# Altium schematic sheet Oscilloscope.schdoc
size 219 x 297 mm
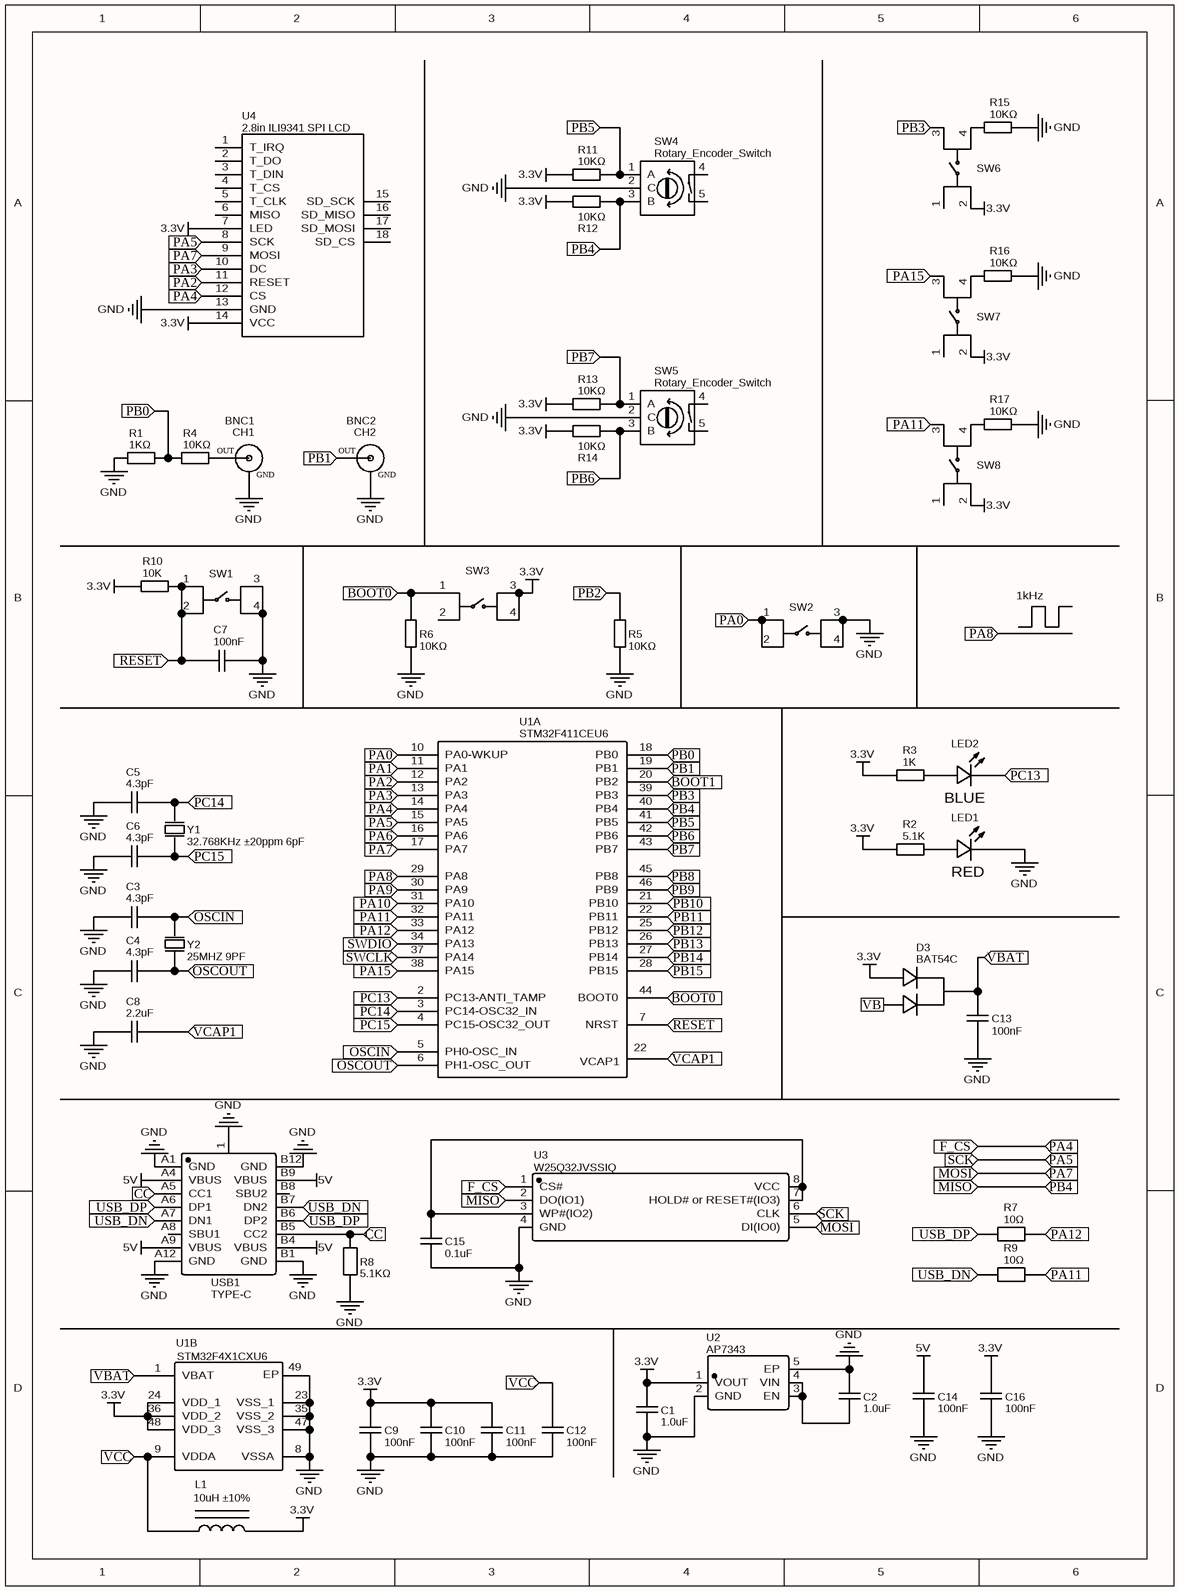
[diagram p0: Oscilloscope.schdoc]

## Parts
BNC1  CH1  [BNC]
BNC2  CH2  [BNC]
C1  1.0uF  [C0603]
C2  1.0uF  [C0603]
C3  4.3pF  [C0603]
C4  4.3pF  [C0603]
C5  4.3pF  [C0603]
C6  4.3pF  [C0603]
C7  100nF  [0603_1608METRIC_PAD1.05X0.95MM_HANDSOLDER]
C8  2.2uF  [C0603]
C9  100nF  [C0603]
C10  100nF  [C0603]
C11  100nF  [C0603]
C12  100nF  [C0603]
C13  100nF  [C0603]
C14  100nF  [C0603]
C15  0.1uF  [C0603]
C16  100nF  [C0603]
D3  BAT54C  [SOT-23-3_L2.9-W1.6-P1.90-LS2.8-BR]
L1  10uH ±10%  [L0603]
LED1  XL-0603QYGC  [LED-0603]  (value not drawn)
LED2  XL-0603QYGC  [LED-0603]  (value not drawn)
R1  1KΩ  [0603_1608METRIC_PAD1.05X0.95MM_HANDSOLDER]
R2  5.1K  [0603_1608METRIC_PAD1.05X0.95MM_HANDSOLDER]
R3  1K  [0603_1608METRIC_PAD1.05X0.95MM_HANDSOLDER]
R4  10KΩ  [0603_1608METRIC_PAD1.05X0.95MM_HANDSOLDER]
R5  10KΩ  [0603_1608METRIC_PAD1.05X0.95MM_HANDSOLDER]
R6  10KΩ  [0603_1608METRIC_PAD1.05X0.95MM_HANDSOLDER]
R7  10Ω  [R0603]
R8  5.1KΩ  [R0603]
R9  10Ω  [R0603]
R10  10K  [0603_1608METRIC_PAD1.05X0.95MM_HANDSOLDER]
R11  10KΩ  [0603_1608METRIC_PAD1.05X0.95MM_HANDSOLDER]
R12  10KΩ  [0603_1608METRIC_PAD1.05X0.95MM_HANDSOLDER]
R13  10KΩ  [0603_1608METRIC_PAD1.05X0.95MM_HANDSOLDER]
R14  10KΩ  [0603_1608METRIC_PAD1.05X0.95MM_HANDSOLDER]
R15  10KΩ  [0603_1608METRIC_PAD1.05X0.95MM_HANDSOLDER]
R16  10KΩ  [0603_1608METRIC_PAD1.05X0.95MM_HANDSOLDER]
R17  10KΩ  [0603_1608METRIC_PAD1.05X0.95MM_HANDSOLDER]
SW1  K2-6639SP-C4SC-04  [KEY-6.0*6.0]  (value not drawn)
SW2  K2-6639SP-C4SC-04  [KEY-6.0*6.0]  (value not drawn)
SW3  K2-6639SP-C4SC-04  [KEY-6.0*6.0]  (value not drawn)
SW4  Rotary_Encoder_Switch
SW5  Rotary_Encoder_Switch
SW6  K2-6639SP-C4SC-04  [KEY-6.0*6.0]  (value not drawn)
SW7  K2-6639SP-C4SC-04  [KEY-6.0*6.0]  (value not drawn)
SW8  K2-6639SP-C4SC-04  [KEY-6.0*6.0]  (value not drawn)
U1A  STM32F411CEU6  [ST-LQFP48]
U1B  STM32F4X1CXU6  [ST-LQFP48]
U2  AP7343  [X2-DFN1010-4_L1.0-W1.0-P0.65-BL-EP]
U3  W25Q32JVSSIQ  [SOIC-8_L5.3-W5.3-P1.27-LS8.0-BL]
U4  2.8in ILI9341 SPI LCD  [2.8IN-ILI9341-SPI-LCD]
USB1  TYPE-C  [TYPE-C-SMD_TYPE-CF3.1]
Y1  32.768KHz ±20ppm 6pF  [OSC-49S-1]
Y2  25MHZ 9PF  [OSC-49S-1]

## Ports
BOOT0 (in), BOOT1 (in), CC (in), F_CS (in), MISO (in), MOSI (in), OSCIN (in), OSCOUT (in), PA0 (in), PA1 (in), PA2 (in), PA3 (in), PA4 (in), PA5 (in), PA6 (in), PA7 (in), PA8 (in), PA9 (in), PA10 (in), PA11 (in), PA12 (in), PA15 (in), PB0 (in), PB1 (in), PB2 (in), PB3 (in), PB4 (in), PB5 (in), PB6 (in), PB7 (in), PB8 (in), PB9 (in), PB10 (in), PB11 (in), PB12 (in), PB13 (in), PB14 (in), PB15 (in), PC13 (in), PC14 (in), PC15 (in), RESET (in), SCK (in), SWCLK (in), SWDIO (in), USB_DN (in), USB_DP (in), VB (in), VBAT (in), VCAP1 (in), VCC (in)

## Nets
3.3V: C1.1 C9.1 C10.1 C11.1 C16.1 D3.1(A1) L1.2 R2.1 R3.1 R10.2 R11.2 R12.2 R13.2 R14.2 SW3.3 SW3.4 SW6.2 SW7.2 SW8.2 U1B.24(VDD_1) U1B.36(VDD_2) U1B.48(VDD_3) U2.1(VOUT) U4.7(LED) U4.14(VCC)
5V: C14.1 USB1.A4(VBUS) USB1.A9(VBUS) USB1.B4(VBUS) USB1.B9(VBUS)
GND: BNC1.GND BNC2.GND C1.2 C2.1 C3.1 C4.1 C5.1 C6.1 C7.2 C8.1 C9.2 C10.2 C11.2 C12.2 C13.2 C14.2 C15.2 C16.2 LED1.2(K) R1.1 R5.1 R6.1 R8.2 R15.1 R16.1 R17.1 SW1.3 SW1.4 SW2.3 SW2.4 SW4.2(C) SW5.2(C) U1B.8(VSSA) U1B.23(VSS_1) U1B.35(VSS_2) U1B.47(VSS_3) U2.2(GND) U2.5(EP) U3.4(GND) U4.13(GND) USB1.1(EH) USB1.A1(GND) USB1.A12(GND) USB1.B1(GND) USB1.B12(GND)
BOOT0: R6.2 SW3.1 U1A.44(BOOT0) ; port BOOT0
BOOT1: U1A.20(PB2) ; port BOOT1
CC: R8.1 USB1.A5(CC1) USB1.B5(CC2) ; port CC
F_CS: U1A.14(PA4) U3.1(CS#) U4.12(CS) ; port PA4, port F_CS
MISO: R12.1 SW4.3(B) U1A.40(PB4) U3.2(DO(IO1)) ; port PB4, port MISO
MOSI: U1A.17(PA7) U3.5(DI(IO0)) U4.9(MOSI) ; port PA7, port MOSI
OSCIN: C3.2 U1A.5(PH0-OSC_IN) Y2.1(OSC1) ; port OSCIN
OSCOUT: C4.2 U1A.6(PH1-OSC_OUT) Y2.2(OSC2) ; port OSCOUT
PA0: SW2.1 SW2.2 U1A.10(PA0-WKUP) ; port PA0
PA1: U1A.11(PA1) ; port PA1
PA2: U1A.12(PA2) U4.11(RESET) ; port PA2
PA3: U1A.13(PA3) U4.10(DC) ; port PA3
PA5: U1A.15(PA5) U3.6(CLK) U4.8(SCK) ; port PA5, port SCK
PA6: U1A.16(PA6) ; port PA6
PA8: U1A.29(PA8) ; port PA8
PA9: U1A.30(PA9) ; port PA9
PA10: U1A.31(PA10) ; port PA10
PA11: R9.2 SW8.3 U1A.32(PA11) ; port PA11
PA12: R7.2 U1A.33(PA12) ; port PA12
PA15: SW7.3 U1A.38(PA15) ; port PA15
PB0: R1.2 R4.1 U1A.18(PB0) ; port PB0
PB1: BNC2.S(OUT) U1A.19(PB1) ; port PB1
PB2: R5.2 ; port PB2
PB3: SW6.3 U1A.39(PB3) ; port PB3
PB5: R11.1 SW4.1(A) U1A.41(PB5) ; port PB5
PB6: R14.1 SW5.3(B) U1A.42(PB6) ; port PB6
PB7: R13.1 SW5.1(A) U1A.43(PB7) ; port PB7
PB8: U1A.45(PB8) ; port PB8
PB9: U1A.46(PB9) ; port PB9
PB10: U1A.21(PB10) ; port PB10
PB11: U1A.22(PB11) ; port PB11
PB12: U1A.25(PB12) ; port PB12
PB13: U1A.26(PB13) ; port PB13
PB14: U1A.27(PB14) ; port PB14
PB15: U1A.28(PB15) ; port PB15
PC13: LED2.2(K) U1A.2(PC13-ANTI_TAMP) ; port PC13
PC14: C5.2 U1A.3(PC14-OSC32_IN) Y1.1(OSC1) ; port PC14
PC15: C6.2 U1A.4(PC15-OSC32_OUT) Y1.2(OSC2) ; port PC15
RESET: C7.1 R10.1 SW1.1 SW1.2 U1A.7(NRST) ; port RESET
SWCLK: U1A.37(PA14) ; port SWCLK
SWDIO: U1A.34(PA13) ; port SWDIO
USB_DN: R9.1 USB1.A7(DN1) USB1.B7(DN2) ; port USB_DN
USB_DP: R7.1 USB1.A6(DP1) USB1.B6(DP2) ; port USB_DP
VB: D3.2(A2) ; port VB
VBAT: C13.1 D3.3(K) U1B.1(VBAT) ; port VBAT
VCAP1: C8.2 ; port VCAP1
VCC: C12.1 L1.1 U1B.9(VDDA) ; port VCC
NetBNC1_S: BNC1.S(OUT) R4.2
NetC2_2: C2.2 U2.3(EN) U2.4(VIN)
NetC15_1: C15.1 U3.3(WP#(IO2)) U3.7(HOLD#_or_RESET#(IO3)) U3.8(VCC)
NetLED1_1: LED1.1(A) R2.2
NetLED2_1: LED2.1(A) R3.2
NetR15_2: R15.2 SW6.4
NetR16_2: R16.2 SW7.4
NetR17_2: R17.2 SW8.4

Not connected (* = marked no-connect by the designer): SW3 2; SW4 4 5; SW5 4 5; SW6 1; SW7 1; SW8 1; U4 1(T_IRQ) 2(T_DO) 3(T_DIN) 4(T_CS) 5(T_CLK) 6(MISO) 15(SD_SCK) 16(SD_MISO) 17(SD_MOSI) 18(SD_CS); USB1 A8(SBU1) B8(SBU2)

## Notes on the sheet
- 1kHz
- BLUE
- (near LED1) RED
- (near U1A) VCAP1
- (near U1A) 22
- (near U1B) EP
- (near U1B) 49

## Library data of the parts
BNC1 = CH1: Contributor: SparkFun; spicePre: U; spiceSymbolName: BNC
BNC2 = CH2: Contributor: SparkFun; spicePre: U; spiceSymbolName: BNC
C1 C2 = 1.0uF: nameAlias: Value(F); Contributor: LCEDA_Lib; spicePre: C; spiceSymbolName: C_0603_US
C3-C6 = 4.3pF: nameAlias: Value(F); Contributor: LCEDA_Lib; spicePre: C; spiceSymbolName: C_0603_US
C7 = 100nF: Manufacturer Part: CL10A105KO8NNNC; Manufacturer: SAMSUNG; nameAlias: Capacitance; Supplier: LCSC; Supplier Part: C1592; spicePre: C; spiceSymbolName: CL10A105KO8NNNC
C8 = 2.2uF: nameAlias: Value(F); Contributor: LCEDA_Lib; spicePre: C; spiceSymbolName: C_0603_US
C9-C14 C16 = 100nF: nameAlias: Value(F); Contributor: LCEDA_Lib; spicePre: C; spiceSymbolName: C_0603_US
C15 = 0.1uF: nameAlias: Value(F); Contributor: LCEDA_Lib; spicePre: C; spiceSymbolName: C_0603_US
D3 = BAT54C: Manufacturer: CJ(江苏长电/长晶); Supplier: LCSC; Manufacturer Part: BAT54C; Supplier Part: C2135; JLCPCB Part Class: Extended Part; spicePre: D; spiceSymbolName: BAT54C
L1 = 10uH ±10%: nameAlias: Value(H); Contributor: LCEDA_Lib; spicePre: L; spiceSymbolName: L0603_US
LED1 LED2 = XL-0603QYGC: Manufacturer: KENTO; Supplier: LCSC; Manufacturer Part: XL-0603QYGC; image: //image.lceda.cn/szlcsc/C2289.jpg; Supplier Part: C2289; spicePre: L
R1 = 1KΩ: Manufacturer: YAGEO; Manufacturer Part: RC0603FR-07510RL; nameAlias: Resistance (Ohms); Supplier: LCSC; Supplier Part: C114670; spicePre: R; spiceSymbolName: RC0603FR-07510RL
R2 = 5.1K: Manufacturer: YAGEO; Manufacturer Part: RC0603FR-07510RL; nameAlias: Resistance (Ohms); Supplier: LCSC; Supplier Part: C114670; spicePre: R; spiceSymbolName: RC0603FR-07510RL
R3 = 1K: Manufacturer: YAGEO; Manufacturer Part: RC0603FR-07510RL; nameAlias: Resistance (Ohms); Supplier: LCSC; Supplier Part: C114670; spicePre: R; spiceSymbolName: RC0603FR-07510RL
R4-R6 R11-R17 = 10KΩ: Manufacturer: YAGEO; Manufacturer Part: RC0603FR-07510RL; nameAlias: Resistance (Ohms); Supplier: LCSC; Supplier Part: C114670; spicePre: R; spiceSymbolName: RC0603FR-07510RL
R7 R9 = 10Ω: nameAlias: Value(Ω); Contributor: LCEDA_Lib; spicePre: R; spiceSymbolName: R_0603_EU
R8 = 5.1KΩ: nameAlias: Value(Ω); Contributor: LCEDA_Lib; spicePre: R; spiceSymbolName: R_0603_EU
R10 = 10K: Manufacturer: YAGEO; Manufacturer Part: RC0603JR-0710KL; nameAlias: Resistance (Ohms); Supplier: LCSC; Supplier Part: C99198; spicePre: R; spiceSymbolName: RC0603JR-0710KL
SW1-SW3 SW6-SW8 = K2-6639SP-C4SC-04: Manufacturer: HRO; Supplier: LCSC; Manufacturer Part: K2-6639SP-C4SC-04; Supplier Part: C83206; spicePre: K
SW4 SW5 = Rotary_Encoder_Switch: Contributor: vosemvosemsot; license: https://www.gnu.org/licenses/lgpl-2.1.html; spicePre: S; spiceSymbolName: Rotary_Encoder_Switch
U1A = STM32F411CEU6: Manufacturer: ST; Manufacturer Part: STM32F103C8T6; subpart_no: 1; tags: STM32; timeStamp: 1455028086; Supplier Part: C8734; Supplier: LCSC; image: http://image.lceda.cn/szlcsc/C8734.jpg; spicePre: U
U1B = STM32F4X1CXU6: Manufacturer: ST; Manufacturer Part: STM32F103C8T6; subpart_no: 2; tags: STM32; timeStamp: 1455028086; Supplier Part: C8734; Supplier: LCSC; image: http://image.lceda.cn/szlcsc/C8734.jpg; spicePre: U
U2 = AP7343: Manufacturer: DIODES(美台); Manufacturer Part: AP7343D-22FS4-7B; Contributor: LCSC; Supplier: LCSC; Supplier Part: C559585; spicePre: U; spiceSymbolName: AP7343D-22FS4-7B
U3 = W25Q32JVSSIQ: Manufacturer: WINBOND(华邦); Contributor: LCSC; Supplier: LCSC; Supplier Part: C179173; Manufacturer Part: W25Q32JVSSIQ; JLCPCB Part Class: Extended Part; spicePre: U; spiceSymbolName: W25Q32JVSSIQ_C179173
U4 = 2.8in ILI9341 SPI LCD: Contributor: ananya0211; spicePre: U; spiceSymbolName: 2.8in ILI9341 SPI LCD
USB1 = TYPE-C: Manufacturer: CIKI(皓富); Manufacturer Part: TYPE-C-2.0-16PIN-SMT-3; Contributor: lcsc; Supplier: LCSC; Supplier Part: C2987386; JLCPCB Part Class: Extended Part; spicePre: U; spiceSymbolName: TYPE-C-2.0-16PIN-SMT-3
Y1 = 32.768KHz ±20ppm 6pF: Manufacturer: YXC; Manufacturer Part: X49SD8MSD2SC; nameAlias: Frequency; Supplier: LCSC; Supplier Part: C21263; spicePre: X; spiceSymbolName: X49SD8MSD2SC
Y2 = 25MHZ 9PF: Manufacturer: YXC; Manufacturer Part: X49SD8MSD2SC; nameAlias: Frequency; Supplier: LCSC; Supplier Part: C21263; spicePre: X; spiceSymbolName: X49SD8MSD2SC